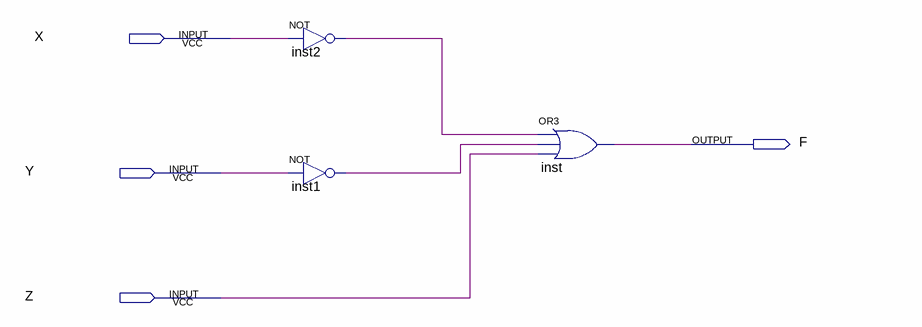
[diagram p0: schematic sheet]
// Quartus schematic Circuito-F.bdf as structural Verilog: 3 symbols, 4 pins
module \Circuito-F  (
  input  X,
  input  Y,
  input  Z,
  output F
);

  wire inst1_out, inst2_out;

  not inst2 (inst2_out, X);
  not inst1 (inst1_out, Y);
  or inst (F, inst2_out, inst1_out, Z);
endmodule
